# EAGLE design Nu6509_test (EAGLE 7.7.0)
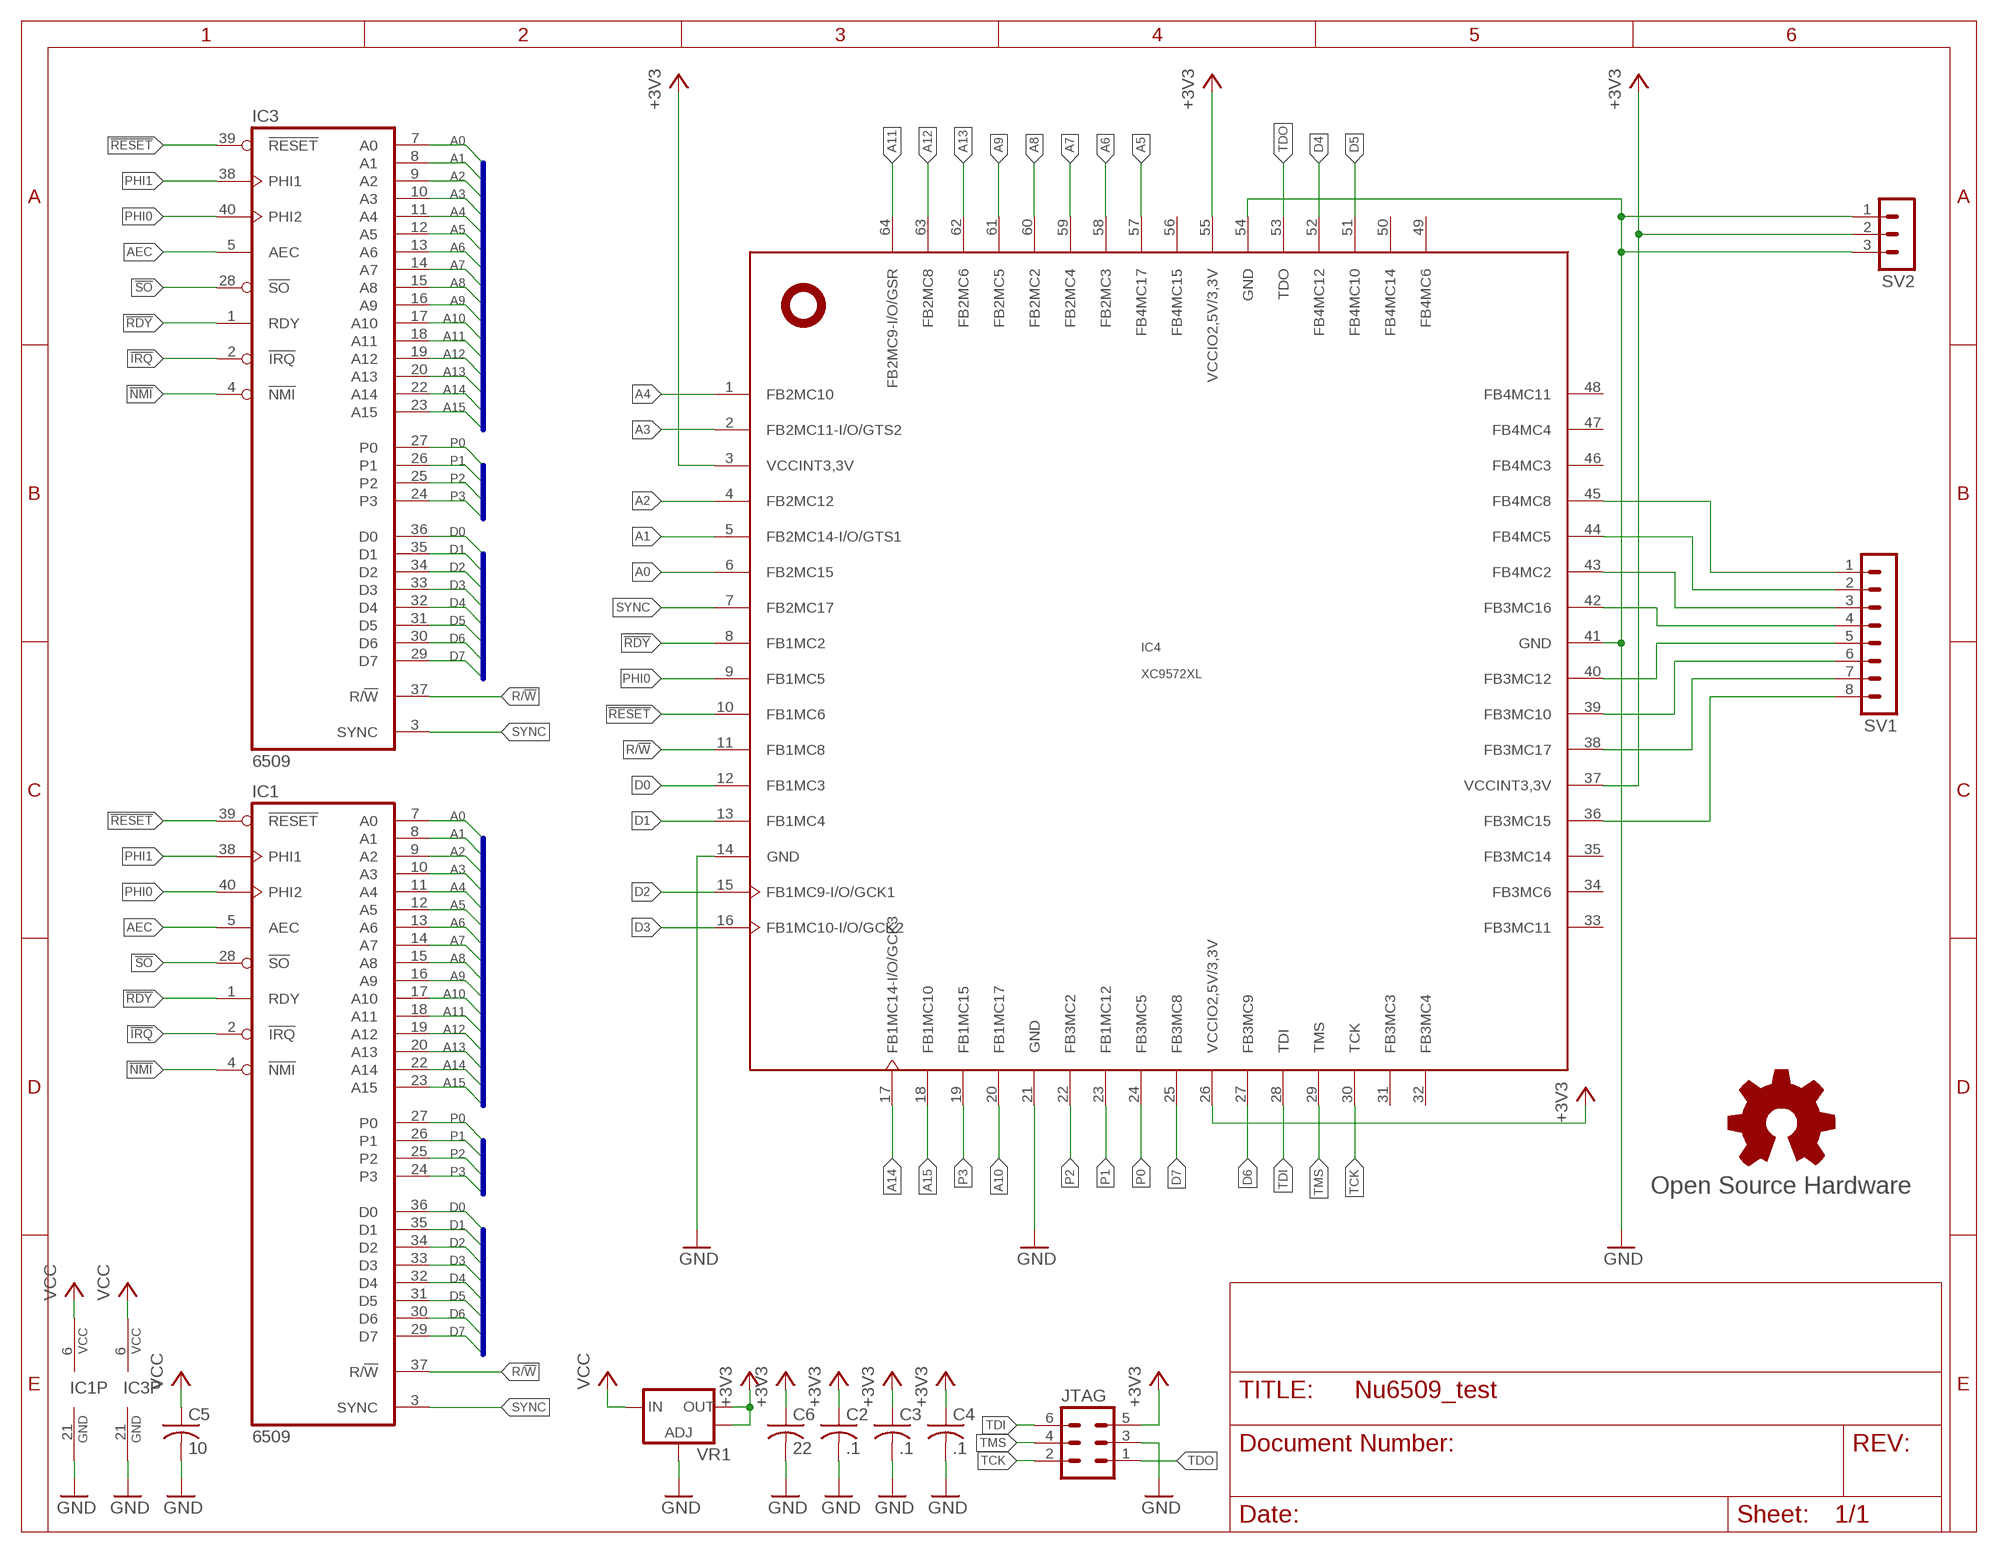
[diagram p0: schematic, sheet 1]

## Parts
C2  .1  C-USC0402  [C0402]
C3  .1  C-USC0402  [C0402]
C4  .1  C-USC0402  [C0402]
C5  10  C-USC0805  [C0805]
C6  22  C-USC0805  [C0805]
GOLD_ORB_SM1  Open Source Hardware  OSHWLOGOLOGO5MM  [OSHW_5MM]
IC1  6509  6509-RP  [DIL40-ROUNDPAD]
IC3  6509  6509-RP  [DIL40-ROUNDPAD]
IC4  XC9572XL  XC9572XLVQG64  [VQFP64]
JTAG  MA03-2  [MA03-2]
SV1  MA08-1  [MA08-1]
SV2  MA03-1  [MA03-1]
VR1  V_REG_LM1117SOT223  [SOT223]

## Nets
!IRQ: IC1.2(!IRQ) IC3.2(!IRQ)
!NMI: IC1.4(!NMI) IC3.4(!NMI)
!RDY: IC1.1(RDY) IC3.1(RDY) IC4.8(FB1MC2)
!RESET: IC1.39(!RESET) IC3.39(!RESET) IC4.10(FB1MC6)
!SO: IC1.28(!SO) IC3.28(!SO)
+3V3: C2.1 C3.1 C4.1 C6.1 IC4.3(VCCINT3,3V) IC4.26(VCCIO2,5V/3,3V) IC4.37(VCCINT3,3V) IC4.55(VCCIO2,5V/3,3V) JTAG.5 SV2.2 VR1.2(OUT) VR1.4(OUT)
A0: IC1.7(A0) IC3.7(A0) IC4.6(FB2MC15)
A1: IC1.8(A1) IC3.8(A1) IC4.5(FB2MC14-I/O/GTS1)
A2: IC1.9(A2) IC3.9(A2) IC4.4(FB2MC12)
A3: IC1.10(A3) IC3.10(A3) IC4.2(FB2MC11-I/O/GTS2)
A4: IC1.11(A4) IC3.11(A4) IC4.1(FB2MC10)
A5: IC1.12(A5) IC3.12(A5) IC4.57(FB4MC17)
A6: IC1.13(A6) IC3.13(A6) IC4.58(FB2MC3)
A7: IC1.14(A7) IC3.14(A7) IC4.59(FB2MC4)
A8: IC1.15(A8) IC3.15(A8) IC4.60(FB2MC2)
A9: IC1.16(A9) IC3.16(A9) IC4.61(FB2MC5)
A10: IC1.17(A10) IC3.17(A10) IC4.20(FB1MC17)
A11: IC1.18(A11) IC3.18(A11) IC4.64(FB2MC9-I/O/GSR)
A12: IC1.19(A12) IC3.19(A12) IC4.63(FB2MC8)
A13: IC1.20(A13) IC3.20(A13) IC4.62(FB2MC6)
A14: IC1.22(A14) IC3.22(A14) IC4.17(FB1MC14-I/O/GCK3)
A15: IC1.23(A15) IC3.23(A15) IC4.18(FB1MC10)
AEC: IC1.5(AEC) IC3.5(AEC)
D0: IC1.36(D0) IC3.36(D0) IC4.12(FB1MC3)
D1: IC1.35(D1) IC3.35(D1) IC4.13(FB1MC4)
D2: IC1.34(D2) IC3.34(D2) IC4.15(FB1MC9-I/O/GCK1)
D3: IC1.33(D3) IC3.33(D3) IC4.16(FB1MC10-I/O/GCK2)
D4: IC1.32(D4) IC3.32(D4) IC4.52(FB4MC12)
D5: IC1.31(D5) IC3.31(D5) IC4.51(FB4MC10)
D6: IC1.30(D6) IC3.30(D6) IC4.27(FB3MC9)
D7: IC1.29(D7) IC3.29(D7) IC4.25(FB3MC8)
GND: C2.2 C3.2 C4.2 C5.2 C6.2 IC1.21(GND) IC3.21(GND) IC4.14(GND) IC4.21(GND) IC4.41(GND) IC4.54(GND) JTAG.3 SV2.1 SV2.3 VR1.1(ADJ)
N$1: IC4.40(FB3MC12) SV1.5
N$2: IC4.42(FB3MC16) SV1.4
N$3: IC4.43(FB4MC2) SV1.3
N$4: IC4.44(FB4MC5) SV1.2
N$5: IC4.45(FB4MC8) SV1.1
N$6: IC4.39(FB3MC10) SV1.6
N$7: IC4.38(FB3MC17) SV1.7
N$8: IC4.36(FB3MC15) SV1.8
P0: IC1.27(P0) IC3.27(P0) IC4.24(FB3MC5)
P1: IC1.26(P1) IC3.26(P1) IC4.23(FB1MC12)
P2: IC1.25(P2) IC3.25(P2) IC4.22(FB3MC2)
P3: IC1.24(P3) IC3.24(P3) IC4.19(FB1MC15)
PHI0: IC1.40(PHI2) IC3.40(PHI2) IC4.9(FB1MC5)
PHI1: IC1.38(PHI1) IC3.38(PHI1)
R/!W: IC1.37(R/!W) IC3.37(R/!W) IC4.11(FB1MC8)
SYNC: IC1.3(SYNC) IC3.3(SYNC) IC4.7(FB2MC17)
TCK: IC4.30(TCK) JTAG.2
TDI: IC4.28(TDI) JTAG.6
TDO: IC4.53(TDO) JTAG.1
TMS: IC4.29(TMS) JTAG.4
VCC: C5.1 IC1.6(VCC) IC3.6(VCC) VR1.3(IN)
Unconnected: IC4.31(FB3MC3) IC4.32(FB3MC4) IC4.33(FB3MC11) IC4.34(FB3MC6) IC4.35(FB3MC14) IC4.46(FB4MC3) IC4.47(FB4MC4) IC4.48(FB4MC11) IC4.49(FB4MC6) IC4.50(FB4MC14) IC4.56(FB4MC15)

## Buses
A[0..15]
D[0..7]
P[0..3]

## Library data of the parts
C2-C6 = rcl:C-US: CAPACITOR, American symbol
GOLD_ORB_SM1 = oshw:OSHWLOGO: The OSHW logo for PCB layout
IC1 IC3 = commodore:6509
IC4 = xilinx_xc95XXXxl:XC9572XLVQG64
JTAG = con-lstb:MA03-2: PIN HEADER; OC_FARNELL: unknown; OC_NEWARK: unknown
SV1 = con-lstb:MA08-1: PIN HEADER; OC_FARNELL: unknown; OC_NEWARK: unknown
SV2 = con-lstb:MA03-1: PIN HEADER; OC_FARNELL: unknown; OC_NEWARK: unknown
VR1 = SparkFun:V_REG_LM1117: Voltage Regulator LM1117 Standard adjustable voltage regulator but in SMD form. Spark Fun Electronics SKU : COM-00595

## Board
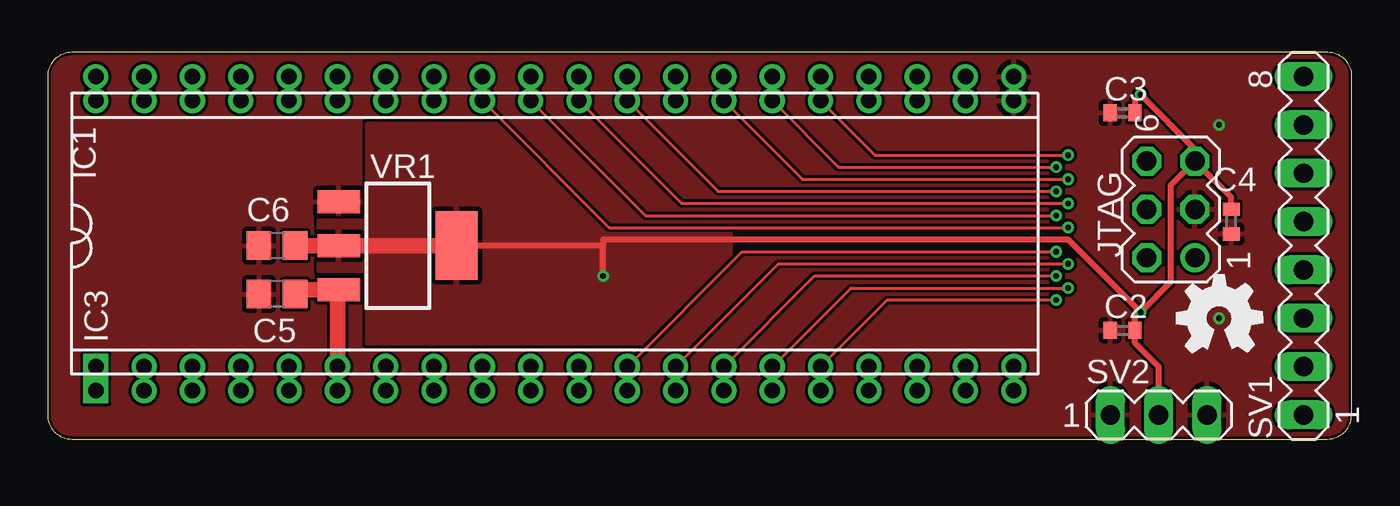
[diagram p1: board, top side]
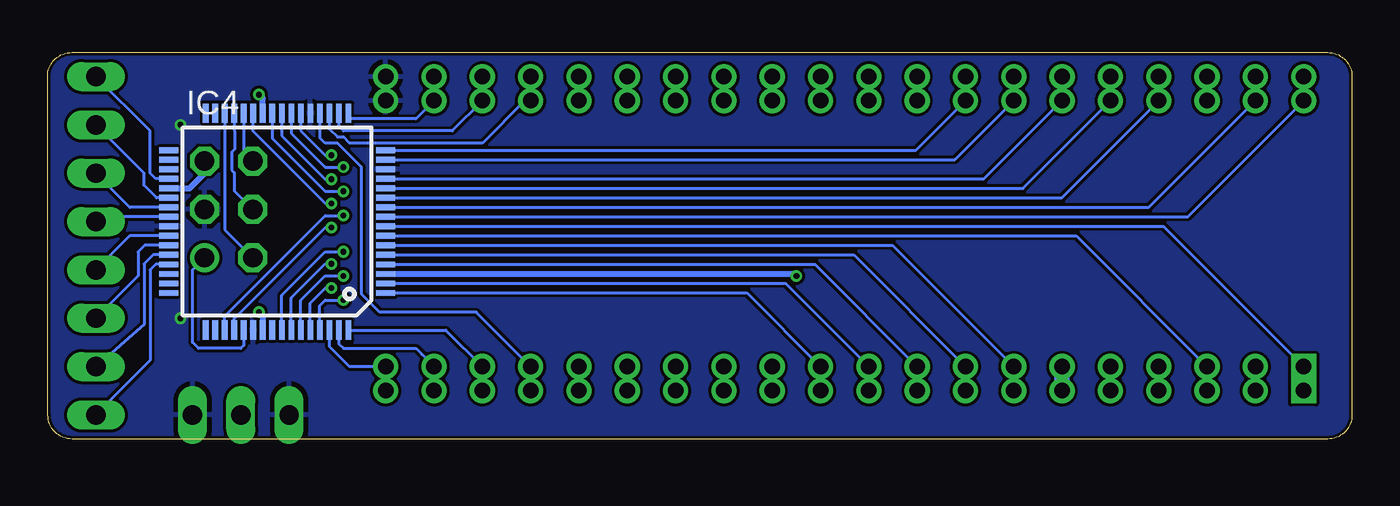
[diagram p2: board, bottom side, seen from below]

Size 68.58 x 20.32 mm. Coordinates in mm from the lower left corner, seen from the top.
Outline: 0,19.05 0,1.27 arc90 1.27,0 67.29,0 arc90 68.56,1.27 68.58,19.05 arc90 67.31,20.32 1.27,20.32 arc90 0,19.05
Copper layers (1*16): Top 0.035mm / dielectric 1.5mm / Bottom 0.035mm
Design rules "hackvana": minimum track width 6mil, minimum drill 0.3mm, track to track 6mil, track to pad 6mil, pad to pad 6mil, via to via 6mil, smd to smd 0mil, copper to edge 6mil, drill to drill 6mil, minimum pad ring 10mil, minimum via ring 6mil, stop-mask expansion 2mil, vias tented up to drill 100mil, thermal gap 10mil

### Footprints (pad centres in the part's own frame; a part is rotated, then mirrored left to right if it is on the bottom)
C0402 = smd 0.7 x 0.9: 1 -0.65,0; 2 0.65,0
C0805 = smd 1.3 x 1.5: 1 -0.95,0; 2 0.95,0
DIL40-ROUNDPAD = drill 0.813 square: 1 -24.13,-7.62 | drill 0.813: 2 -21.59,-7.62; 3 -19.05,-7.62; 4 -16.51,-7.62; 5 -13.97,-7.62; 6 -11.43,-7.62; 7 -8.89,-7.62; 8 -6.35,-7.62; 9 -3.81,-7.62; 10 -1.27,-7.62; 11 1.27,-7.62; 12 3.81,-7.62; 13 6.35,-7.62; 14 8.89,-7.62; 15 11.43,-7.62; 16 13.97,-7.62; 17 16.51,-7.62; 18 19.05,-7.62; 19 21.59,-7.62; 20 24.13,-7.62; 21 24.13,7.62; 22 21.59,7.62; 23 19.05,7.62; 24 16.51,7.62; 25 13.97,7.62; 26 11.43,7.62; 27 8.89,7.62; 28 6.35,7.62; 29 3.81,7.62; 30 1.27,7.62; 31 -1.27,7.62; 32 -3.81,7.62; 33 -6.35,7.62; 34 -8.89,7.62; 35 -11.43,7.62; 36 -13.97,7.62; 37 -16.51,7.62; 38 -19.05,7.62; 39 -21.59,7.62; 40 -24.13,7.62
VQFP64 = smd 1 x 0.3: 1 -5.7,3.75; 2 -5.7,3.25; 3 -5.7,2.75; 4 -5.7,2.25; 5 -5.7,1.75; 6 -5.7,1.25; 7 -5.7,0.75; 8 -5.7,0.25; 9 -5.7,-0.25; 10 -5.7,-0.75; 11 -5.7,-1.25; 12 -5.7,-1.75; 13 -5.7,-2.25; 14 -5.7,-2.75; 15 -5.7,-3.25; 16 -5.7,-3.75; 33 5.7,-3.75; 34 5.7,-3.25; 35 5.7,-2.75; 36 5.7,-2.25; 37 5.7,-1.75; 38 5.7,-1.25; 39 5.7,-0.75; 40 5.7,-0.25; 41 5.7,0.25; 42 5.7,0.75; 43 5.7,1.25; 44 5.7,1.75; 45 5.7,2.25; 46 5.7,2.75; 47 5.7,3.25; 48 5.7,3.75 | smd 0.3 x 1: 17 -3.75,-5.7; 18 -3.25,-5.7; 19 -2.75,-5.7; 20 -2.25,-5.7; 21 -1.75,-5.7; 22 -1.25,-5.7; 23 -0.75,-5.7; 24 -0.25,-5.7; 25 0.25,-5.7; 26 0.75,-5.7; 27 1.25,-5.7; 28 1.75,-5.7; 29 2.25,-5.7; 30 2.75,-5.7; 31 3.25,-5.7; 32 3.75,-5.7; 49 3.75,5.7; 50 3.25,5.7; 51 2.75,5.7; 52 2.25,5.7; 53 1.75,5.7; 54 1.25,5.7; 55 0.75,5.7; 56 0.25,5.7; 57 -0.25,5.7; 58 -0.75,5.7; 59 -1.25,5.7; 60 -1.75,5.7; 61 -2.25,5.7; 62 -2.75,5.7; 63 -3.25,5.7; 64 -3.75,5.7
MA03-2 = drill 1.016: 1 -2.54,-1.27 | drill 1.016 octagon: 2 -2.54,1.27; 3 0,-1.27; 4 0,1.27; 5 2.54,-1.27; 6 2.54,1.27
MA08-1 = drill 1.016 long: 1 -8.89,0; 2 -6.35,0; 3 -3.81,0; 4 -1.27,0; 5 1.27,0; 6 3.81,0; 7 6.35,0; 8 8.89,0
MA03-1 = drill 1.016 long: 1 -2.54,0; 2 0,0; 3 2.54,0
SOT223 = smd 1.219 x 2.235: 1 -2.311,-3.099; 2 0,-3.099; 3 2.311,-3.099 | smd 3.6 x 2.2: 4 0,3.099

### Placement (x,y rotation side)
C2  56.52,5.71 180 top
C3  56.52,17.14 180 top
C4  62.23,11.43 270 top
C5  12.06,7.62 180 top
C6  12.06,10.16 180 top
GOLD_ORB_SM1  61.59,6.35 0 top
IC1  26.67,11.43 0 top
IC3  26.67,10.16 0 top
IC4  56.52,11.43 180 bottom
JTAG  59.06,12.06 90 top
SV1  66.04,10.16 90 top
SV2  58.42,1.27 0 top
VR1  18.41,10.16 270 top

### Tracks (layer width: path | path; a pad name or v marks a point on that pad's centre or on a via)
!IRQ
  Bottom 0.152: IC1.2 IC3.2
!NMI
  Bottom 0.152: IC1.4 IC3.4
!RDY
  Bottom 0.152: IC4.8 9.91,11.18 IC1.1 IC3.1
!RESET
  Bottom 0.152: IC1.39 IC3.39 10.68,12.18 IC4.10
!SO
  Bottom 0.152: IC1.28 IC3.28
+3V3  (via drill 0.3)
  Top 0.305: v29.21,8.57 29.21,10.16 | 29.21,10.16 VR1.4 | v57.47,6.67 57.16,6.37 C2.1 57.16,5.07 58.42,3.81 SV2.2 | v57.47,6.67 59.06,8.26 59.06,13.34 JTAG.5 | C4.1 62.23,12.7 JTAG.5 | C3.1 57.16,17.8 v57.47,18.1 60.33,15.24 JTAG.5 | 29.21,10.16 29.21,10.48 53.66,10.48 v57.47,6.67
  Top 0.813: VR1.4 VR1.2 C6.1
  Bottom 0.305: IC4.3 29.21,8.68 v29.21,8.57 | v57.47,6.67 57.27,6.46 IC4.55 | IC4.37 61.11,13.18 60.33,13.97 JTAG.5 | IC4.26 57.27,17.89 v57.47,18.1
  pour Top: 16.83,16.51 16.83,11.43 14.29,11.43 14.29,8.89 16.83,8.89 16.83,5.08 31.43,5.08 35.88,9.53 35.88,10.79 29.53,10.79 23.81,16.51
A0
  Bottom 0.152: IC4.6 24.15,10.18 IC1.7 IC3.7
A1
  Bottom 0.152: IC4.5 26.19,9.68 IC1.8 IC3.8
A2
  Bottom 0.152: IC4.4 28.23,9.18 IC1.9 IC3.9
A3
  Bottom 0.152: IC4.2 29.77,8.18 IC1.10 IC3.10
A4
  Bottom 0.152: IC4.1 31.81,7.68 IC1.11 IC3.11
A5  (via drill 0.3)
  Top 0.152: IC1.12 36.51,9.84 v53.02,9.84
  Bottom 0.152: v53.02,9.84 53.98,9.84 56.27,7.55 IC4.57 | IC1.12 IC3.12
A6  (via drill 0.3)
  Top 0.152: IC1.13 38.42,9.21 v53.66,9.21
  Bottom 0.152: IC4.58 55.77,7.42 53.98,9.21 v53.66,9.21 | IC1.13 IC3.13
A7  (via drill 0.3)
  Top 0.152: IC1.14 40.32,8.57 v53.02,8.57
  Bottom 0.152: v53.02,8.57 53.98,8.57 55.27,7.28 IC4.59 | IC1.14 IC3.14
A8  (via drill 0.3)
  Top 0.152: IC1.15 42.23,7.94 v53.66,7.94
  Bottom 0.152: IC4.60 54.77,7.15 53.98,7.94 v53.66,7.94 | IC1.15 IC3.15
A9  (via drill 0.3)
  Top 0.152: IC1.16 44.13,7.3 v53.02,7.3
  Bottom 0.152: IC4.61 54.27,7.01 53.98,7.3 v53.02,7.3 | IC1.16 IC3.16
A10
  Bottom 0.152: IC3.17 IC1.17 46.04,6.67 51.12,6.67 52.07,7.62 52.07,14.29 53.34,15.56 53.98,15.56 54.27,15.85 IC4.20
A11
  Bottom 0.152: IC4.64 47.64,5.73 IC1.18 IC3.18
A12
  Bottom 0.152: IC3.19 IC1.19 48.9,4.45 49.21,4.76 53.02,4.76 53.27,5 IC4.63
A13
  Bottom 0.152: IC4.62 53.77,4.87 52.7,3.81 IC1.20 IC3.20
A14
  Bottom 0.152: IC1.22 IC3.22 49.21,16.83 52.77,16.83 IC4.17
A15
  Bottom 0.152: IC1.23 IC3.23 47.31,16.19 53.02,16.19 53.27,16.43 IC4.18
AEC
  Bottom 0.152: IC1.5 IC3.5
D0
  Bottom 0.152: IC4.12 17.3,13.18 IC3.36 IC1.36
D1
  Bottom 0.152: IC4.13 19.34,13.68 IC3.35 IC1.35
D2
  Bottom 0.152: IC4.15 20.88,14.68 IC3.34 IC1.34
D3
  Bottom 0.152: IC4.16 22.92,15.18 IC3.33 IC1.33
D4  (via drill 0.3)
  Top 0.152: v53.66,11.11 29.53,11.11 IC3.32
  Bottom 0.152: v53.66,11.11 53.98,11.11 58.77,6.32 IC4.52 | IC1.32 IC3.32
D5  (via drill 0.3)
  Top 0.152: v53.02,11.75 31.43,11.75 IC3.31
  Bottom 0.152: v53.02,11.75 53.98,11.75 59.27,6.46 IC4.51 | IC1.31 IC3.31
D6  (via drill 0.3)
  Top 0.152: v53.66,12.38 33.34,12.38 IC3.30
  Bottom 0.152: v53.66,12.38 53.98,12.38 57.77,16.17 IC4.27 | IC1.30 IC3.30
D7  (via drill 0.3)
  Top 0.152: v53.02,13.02 35.24,13.02 IC3.29
  Bottom 0.152: v53.02,13.02 53.98,13.02 56.77,15.81 IC4.25 | IC1.29 IC3.29
GND  (via drill 0.3)
  other vias: 61.59,16.51 61.59,6.35
  pour Top (rank 2): 1.27,20.32 67.31,20.32 arc-90 68.58,19.05 68.58,1.27 arc-90 67.31,0 1.27,0 arc-90 0,1.27 0,19.05 arc-90
  pour Bottom (rank 2): 1.27,20.32 67.31,20.32 arc-90 68.58,19.05 68.58,1.27 arc-90 67.31,0 1.27,0 arc-90 0,1.27 0,19.05 arc-90
N$1
  Bottom 0.152: IC4.40 65.79,11.68 SV1.5
N$2
  Bottom 0.152: IC4.42 64.25,10.68 SV1.4
N$3
  Bottom 0.152: IC4.43 63.48,10.18 63.82,9.84 63.82,8.57 SV1.3
N$4
  Bottom 0.152: IC4.44 63.03,9.68 63.5,9.21 63.5,6.03 SV1.2
N$5
  Bottom 0.152: IC4.45 62.89,9.18 63.18,8.89 63.18,4.13 SV1.1
N$6
  Bottom 0.152: IC4.39 64.25,12.18 SV1.6
N$7
  Bottom 0.152: IC4.38 62.84,12.68 63.5,13.34 63.5,13.97 SV1.7
N$8
  Bottom 0.152: IC4.36 62.89,13.68 63.18,13.97 63.18,16.19 SV1.8
P0  (via drill 0.3)
  Top 0.152: IC3.27 39.69,13.65 v53.66,13.65
  Bottom 0.152: v53.66,13.65 53.98,13.65 56.27,15.94 IC4.24 | IC1.27 IC3.27
P1  (via drill 0.3)
  Top 0.152: IC3.26 41.59,14.29 v53.02,14.29
  Bottom 0.152: v53.02,14.29 53.98,14.29 55.77,16.08 IC4.23 | IC1.26 IC3.26
P2  (via drill 0.3)
  Top 0.152: v53.66,14.92 43.5,14.92 IC3.25
  Bottom 0.152: v53.66,14.92 53.98,14.92 55.27,16.21 IC4.22 | IC1.25 IC3.25
P3
  Bottom 0.152: IC4.19 53.77,16.3 53.34,15.88 53.02,15.88 52.7,15.56 45.72,15.56 43.5,17.78 IC3.24 IC1.24
PHI0
  Bottom 0.152: IC1.40 IC3.40 8.64,11.68 IC4.9
PHI1
  Bottom 0.152: IC3.38 IC1.38
R/!W
  Bottom 0.152: IC4.11 15.26,12.68 IC3.37 IC1.37
SYNC
  Bottom 0.152: IC4.7 14.49,10.68 IC1.3 IC3.3
TCK
  Bottom 0.152: IC4.30 59.27,11.01 JTAG.2
TDI
  Bottom 0.152: IC4.28 58.27,15.09 JTAG.6
TDO
  Bottom 0.152: IC4.53 58.27,4.92 58.42,4.76 60.64,4.76 60.96,5.08 60.96,8.89 JTAG.1
TMS
  Bottom 0.152: IC4.29 58.74,15.24 58.9,15.08 58.9,14.13 58.77,14 58.77,13.04 JTAG.4
VCC
  Top 0.813: IC1.6 15.24,7.85 VR1.3 13.01,7.85 C5.1
  Bottom 0.813: IC1.6 IC3.6